# EAGLE schematic 6way (EAGLE 6.4)
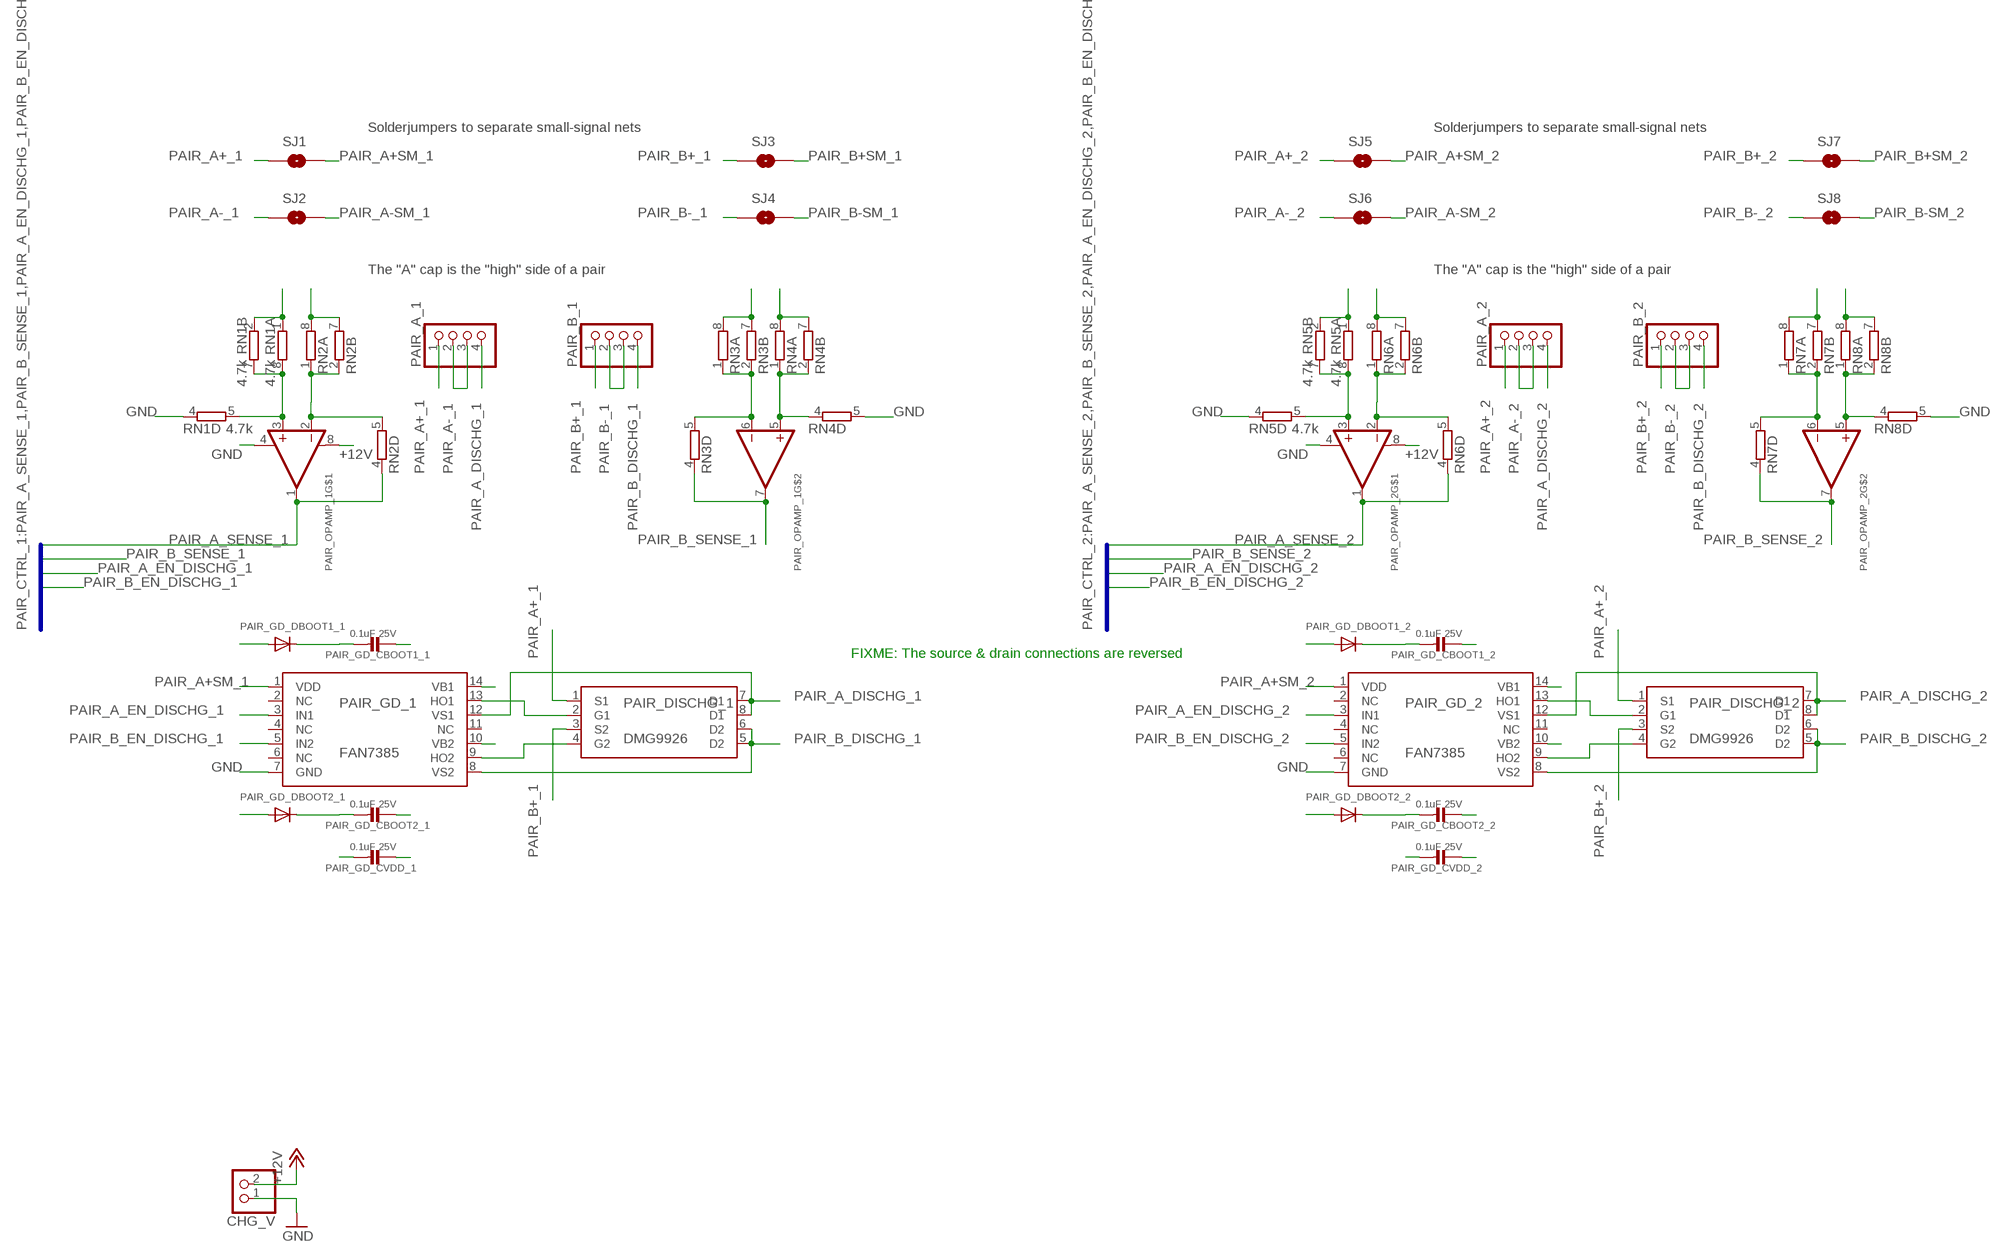
[diagram p0: schematic, sheet 1, part 1 of 2]
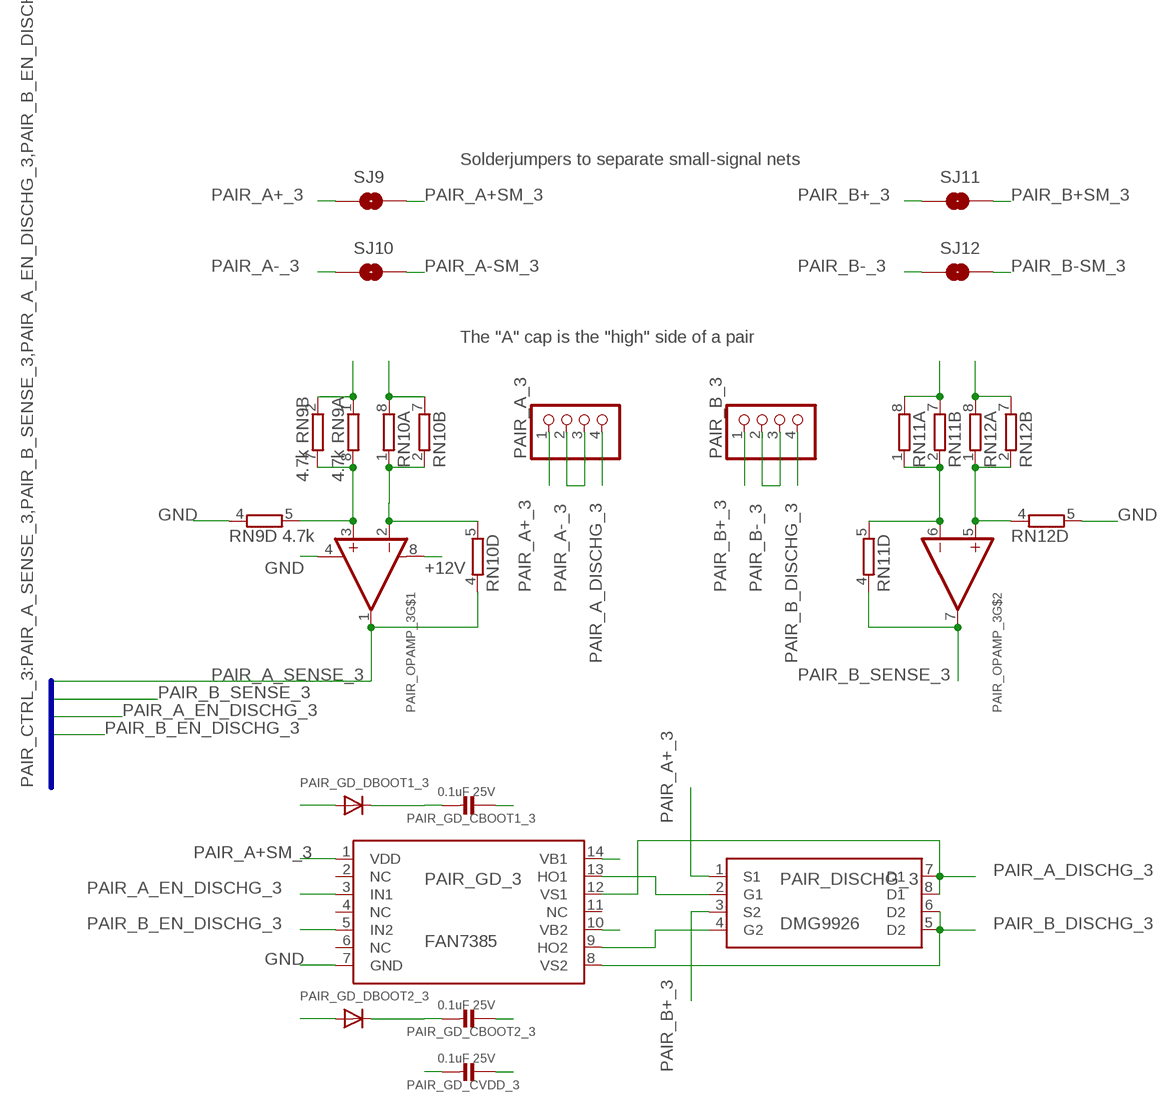
[diagram p1: schematic, sheet 1, part 2 of 2]

## Parts
CHG_V  PINHD-1X2  [1X02]
PAIR_A_1  PINHD-1X4  [1X04]
PAIR_A_2  PINHD-1X4  [1X04]
PAIR_A_3  PINHD-1X4  [1X04]
PAIR_B_1  PINHD-1X4  [1X04]
PAIR_B_2  PINHD-1X4  [1X04]
PAIR_B_3  PINHD-1X4  [1X04]
PAIR_DISCHG_1  DMG9926  [SOP8-L]
PAIR_DISCHG_2  DMG9926  [SOP8-L]
PAIR_DISCHG_3  DMG9926  [SOP8-L]
PAIR_GD_1  FAN7385  [SOT14]
PAIR_GD_2  FAN7385  [SOT14]
PAIR_GD_3  FAN7385  [SOT14]
PAIR_GD_CBOOT1_1  0.1uF 25V  CAP_CERAMIC0805  [0805]
PAIR_GD_CBOOT1_2  0.1uF 25V  CAP_CERAMIC0805  [0805]
PAIR_GD_CBOOT1_3  0.1uF 25V  CAP_CERAMIC0805  [0805]
PAIR_GD_CBOOT2_1  0.1uF 25V  CAP_CERAMIC0805  [0805]
PAIR_GD_CBOOT2_2  0.1uF 25V  CAP_CERAMIC0805  [0805]
PAIR_GD_CBOOT2_3  0.1uF 25V  CAP_CERAMIC0805  [0805]
PAIR_GD_CVDD_1  0.1uF 25V  CAP_CERAMIC0805  [0805]
PAIR_GD_CVDD_2  0.1uF 25V  CAP_CERAMIC0805  [0805]
PAIR_GD_CVDD_3  0.1uF 25V  CAP_CERAMIC0805  [0805]
PAIR_GD_DBOOT1_1  DIODESOT23_WIDE  [SOT23-WIDE]
PAIR_GD_DBOOT1_2  DIODESOT23_WIDE  [SOT23-WIDE]
PAIR_GD_DBOOT1_3  DIODESOT23_WIDE  [SOT23-WIDE]
PAIR_GD_DBOOT2_1  DIODESOT23_WIDE  [SOT23-WIDE]
PAIR_GD_DBOOT2_2  DIODESOT23_WIDE  [SOT23-WIDE]
PAIR_GD_DBOOT2_3  DIODESOT23_WIDE  [SOT23-WIDE]
PAIR_OPAMP_1  LM358  [SOIC8_150MIL]
PAIR_OPAMP_2  LM358  [SOIC8_150MIL]
PAIR_OPAMP_3  LM358  [SOIC8_150MIL]
RN1  4.7k  4R-NCAY16  [CAY16]
RN2  4R-NCAY16  [CAY16]
RN3  4R-NCAY16  [CAY16]
RN4  4R-NCAY16  [CAY16]
RN5  4.7k  4R-NCAY16  [CAY16]
RN6  4R-NCAY16  [CAY16]
RN7  4R-NCAY16  [CAY16]
RN8  4R-NCAY16  [CAY16]
RN9  4.7k  4R-NCAY16  [CAY16]
RN10  4R-NCAY16  [CAY16]
RN11  4R-NCAY16  [CAY16]
RN12  4R-NCAY16  [CAY16]
SJ1  SOLDERJUMPERTRACE  [SJ_2S-TRACE]
SJ2  SOLDERJUMPERTRACE  [SJ_2S-TRACE]
SJ3  SOLDERJUMPERTRACE  [SJ_2S-TRACE]
SJ4  SOLDERJUMPERTRACE  [SJ_2S-TRACE]
SJ5  SOLDERJUMPERTRACE  [SJ_2S-TRACE]
SJ6  SOLDERJUMPERTRACE  [SJ_2S-TRACE]
SJ7  SOLDERJUMPERTRACE  [SJ_2S-TRACE]
SJ8  SOLDERJUMPERTRACE  [SJ_2S-TRACE]
SJ9  SOLDERJUMPERTRACE  [SJ_2S-TRACE]
SJ10  SOLDERJUMPERTRACE  [SJ_2S-TRACE]
SJ11  SOLDERJUMPERTRACE  [SJ_2S-TRACE]
SJ12  SOLDERJUMPERTRACE  [SJ_2S-TRACE]

## Nets
+12V [power]: CHG_V.2 PAIR_OPAMP_1.8(V+) PAIR_OPAMP_2.8(V+) PAIR_OPAMP_3.8(V+)
GND [power]: CHG_V.1 PAIR_GD_1.7(GND) PAIR_GD_2.7(GND) PAIR_GD_3.7(GND) PAIR_GD_CVDD_1.1 PAIR_GD_CVDD_2.1 PAIR_GD_CVDD_3.1 PAIR_OPAMP_1.4(V-) PAIR_OPAMP_2.4(V-) PAIR_OPAMP_3.4(V-) RN1.4 RN4.5 RN5.4 RN8.5 RN9.4 RN12.5
N$1: PAIR_OPAMP_1.6(-IN) RN3.1 RN3.2 RN3.5
N$2: PAIR_OPAMP_1.2(-IN) RN2.1 RN2.2 RN2.5
N$3: PAIR_OPAMP_1.3(+IN) RN1.5 RN1.7 RN1.8
N$4: PAIR_DISCHG_1.2(G1) PAIR_GD_1.13(HO1)
N$5: PAIR_OPAMP_1.5(+IN) RN4.1 RN4.2 RN4.4
N$6: PAIR_DISCHG_1.4(G2) PAIR_GD_1.9(HO2)
N$7: PAIR_OPAMP_2.2(-IN) RN6.1 RN6.2 RN6.5
N$8: PAIR_OPAMP_2.3(+IN) RN5.5 RN5.7 RN5.8
N$9: PAIR_OPAMP_2.6(-IN) RN7.1 RN7.2 RN7.5
N$10: PAIR_OPAMP_2.5(+IN) RN8.1 RN8.2 RN8.4
N$11: PAIR_DISCHG_2.2(G1) PAIR_GD_2.13(HO1)
N$12: PAIR_DISCHG_2.4(G2) PAIR_GD_2.9(HO2)
N$13: PAIR_OPAMP_3.2(-IN) RN10.1 RN10.2 RN10.5
N$14: PAIR_OPAMP_3.3(+IN) RN9.5 RN9.7 RN9.8
N$15: PAIR_OPAMP_3.6(-IN) RN11.1 RN11.2 RN11.5
N$16: PAIR_OPAMP_3.5(+IN) RN12.1 RN12.2 RN12.4
N$17: PAIR_DISCHG_3.2(G1) PAIR_GD_3.13(HO1)
N$18: PAIR_DISCHG_3.4(G2) PAIR_GD_3.9(HO2)
PAIR_A+_1 [high-power]: PAIR_A_1.1 PAIR_DISCHG_1.1(S1) SJ1.1
PAIR_A+_2 [high-power]: PAIR_A_2.1 PAIR_DISCHG_2.1(S1) SJ5.1
PAIR_A+_3 [high-power]: PAIR_A_3.1 PAIR_DISCHG_3.1(S1) SJ9.1
PAIR_A+SM_1: PAIR_GD_1.1(VDD) PAIR_GD_CVDD_1.2 PAIR_GD_DBOOT1_1.1(A) PAIR_GD_DBOOT2_1.1(A) RN1.1 RN1.2 SJ1.2
PAIR_A+SM_2: PAIR_GD_2.1(VDD) PAIR_GD_CVDD_2.2 PAIR_GD_DBOOT1_2.1(A) PAIR_GD_DBOOT2_2.1(A) RN5.1 RN5.2 SJ5.2
PAIR_A+SM_3: PAIR_GD_3.1(VDD) PAIR_GD_CVDD_3.2 PAIR_GD_DBOOT1_3.1(A) PAIR_GD_DBOOT2_3.1(A) RN9.1 RN9.2 SJ9.2
PAIR_A-_1 [high-power]: PAIR_A_1.2 PAIR_A_1.3 SJ2.1
PAIR_A-_2 [high-power]: PAIR_A_2.2 PAIR_A_2.3 SJ6.1
PAIR_A-_3 [high-power]: PAIR_A_3.2 PAIR_A_3.3 SJ10.1
PAIR_A-SM_1: RN2.7 RN2.8 SJ2.2
PAIR_A-SM_2: RN6.7 RN6.8 SJ6.2
PAIR_A-SM_3: RN10.7 RN10.8 SJ10.2
PAIR_A_DISCHG_1 [high-power]: PAIR_A_1.4 PAIR_DISCHG_1.7(D1) PAIR_DISCHG_1.8(D1) PAIR_GD_1.12(VS1) PAIR_GD_CBOOT1_1.1
PAIR_A_DISCHG_2 [high-power]: PAIR_A_2.4 PAIR_DISCHG_2.7(D1) PAIR_DISCHG_2.8(D1) PAIR_GD_2.12(VS1) PAIR_GD_CBOOT1_2.1
PAIR_A_DISCHG_3 [high-power]: PAIR_A_3.4 PAIR_DISCHG_3.7(D1) PAIR_DISCHG_3.8(D1) PAIR_GD_3.12(VS1) PAIR_GD_CBOOT1_3.1
PAIR_A_EN_DISCHG_1: PAIR_GD_1.3(IN1)
PAIR_A_EN_DISCHG_2: PAIR_GD_2.3(IN1)
PAIR_A_EN_DISCHG_3: PAIR_GD_3.3(IN1)
PAIR_A_SENSE_1: PAIR_OPAMP_1.1(OUT) RN2.4
PAIR_A_SENSE_2: PAIR_OPAMP_2.1(OUT) RN6.4
PAIR_A_SENSE_3: PAIR_OPAMP_3.1(OUT) RN10.4
PAIR_B+_1 [high-power]: PAIR_B_1.1 PAIR_DISCHG_1.3(S2) SJ3.1
PAIR_B+_2 [high-power]: PAIR_B_2.1 PAIR_DISCHG_2.3(S2) SJ7.1
PAIR_B+_3 [high-power]: PAIR_B_3.1 PAIR_DISCHG_3.3(S2) SJ11.1
PAIR_B+SM_1: RN4.7 RN4.8 SJ3.2
PAIR_B+SM_2: RN8.7 RN8.8 SJ7.2
PAIR_B+SM_3: RN12.7 RN12.8 SJ11.2
PAIR_B-_1 [high-power]: PAIR_B_1.2 PAIR_B_1.3 SJ4.1
PAIR_B-_2 [high-power]: PAIR_B_2.2 PAIR_B_2.3 SJ8.1
PAIR_B-_3 [high-power]: PAIR_B_3.2 PAIR_B_3.3 SJ12.1
PAIR_B-SM_1: RN3.7 RN3.8 SJ4.2
PAIR_B-SM_2: RN7.7 RN7.8 SJ8.2
PAIR_B-SM_3: RN11.7 RN11.8 SJ12.2
PAIR_B_DISCHG_1 [high-power]: PAIR_B_1.4 PAIR_DISCHG_1.5(D2) PAIR_DISCHG_1.6(D2) PAIR_GD_1.8(VS2) PAIR_GD_CBOOT2_1.1
PAIR_B_DISCHG_2 [high-power]: PAIR_B_2.4 PAIR_DISCHG_2.5(D2) PAIR_DISCHG_2.6(D2) PAIR_GD_2.8(VS2) PAIR_GD_CBOOT2_2.1
PAIR_B_DISCHG_3 [high-power]: PAIR_B_3.4 PAIR_DISCHG_3.5(D2) PAIR_DISCHG_3.6(D2) PAIR_GD_3.8(VS2) PAIR_GD_CBOOT2_3.1
PAIR_B_EN_DISCHG_1: PAIR_GD_1.5(IN2)
PAIR_B_EN_DISCHG_2: PAIR_GD_2.5(IN2)
PAIR_B_EN_DISCHG_3: PAIR_GD_3.5(IN2)
PAIR_B_SENSE_1: PAIR_OPAMP_1.7(OUT) RN3.4
PAIR_B_SENSE_2: PAIR_OPAMP_2.7(OUT) RN7.4
PAIR_B_SENSE_3: PAIR_OPAMP_3.7(OUT) RN11.4
PAIR_GD_VB1_1: PAIR_GD_1.14(VB1) PAIR_GD_CBOOT1_1.2 PAIR_GD_DBOOT1_1.3(C)
PAIR_GD_VB1_2: PAIR_GD_2.14(VB1) PAIR_GD_CBOOT1_2.2 PAIR_GD_DBOOT1_2.3(C)
PAIR_GD_VB1_3: PAIR_GD_3.14(VB1) PAIR_GD_CBOOT1_3.2 PAIR_GD_DBOOT1_3.3(C)
PAIR_GD_VB2_1: PAIR_GD_1.10(VB2) PAIR_GD_CBOOT2_1.2 PAIR_GD_DBOOT2_1.3(C)
PAIR_GD_VB2_2: PAIR_GD_2.10(VB2) PAIR_GD_CBOOT2_2.2 PAIR_GD_DBOOT2_2.3(C)
PAIR_GD_VB2_3: PAIR_GD_3.10(VB2) PAIR_GD_CBOOT2_3.2 PAIR_GD_DBOOT2_3.3(C)
Unconnected: PAIR_GD_1.2(NC) PAIR_GD_1.4(NC) PAIR_GD_1.6(NC) PAIR_GD_1.11(NC) PAIR_GD_2.2(NC) PAIR_GD_2.4(NC) PAIR_GD_2.6(NC) PAIR_GD_2.11(NC) PAIR_GD_3.2(NC) PAIR_GD_3.4(NC) PAIR_GD_3.6(NC) PAIR_GD_3.11(NC) RN1.3 RN1.6 RN2.3 RN2.6 RN3.3 RN3.6 RN4.3 RN4.6 RN5.3 RN5.6 RN6.3 RN6.6 RN7.3 RN7.6 RN8.3 RN8.6 RN9.3 RN9.6 RN10.3 RN10.6 RN11.3 RN11.6 RN12.3 RN12.6

## Buses
PAIR_CTRL_1:PAIR_A_SENSE_1,PAIR_B_SENSE_1,PAIR_A_EN_DISCHG_1,PAIR_B_EN_DISCHG_1
PAIR_CTRL_2:PAIR_A_SENSE_2,PAIR_B_SENSE_2,PAIR_A_EN_DISCHG_2,PAIR_B_EN_DISCHG_2
PAIR_CTRL_3:PAIR_A_SENSE_3,PAIR_B_SENSE_3,PAIR_A_EN_DISCHG_3,PAIR_B_EN_DISCHG_3

## Notes on the sheet
- Solderjumpers to separate small-signal nets | Solderjumpers to separate small-signal nets | Solderjumpers to separate small-signal nets
- The "A" cap is the "high" side of a pair | The "A" cap is the "high" side of a pair | The "A" cap is the "high" side of a pair
- FIXME: The source & drain connections are reversed

## Library data of the parts
CHG_V = pinhead:PINHD-1X2: PIN HEADER
PAIR_A_1-PAIR_A_3 PAIR_B_1-PAIR_B_3 = pinhead:PINHD-1X4: PIN HEADER
PAIR_DISCHG_1-PAIR_DISCHG_3 = DMG9926:DMG9926
PAIR_GD_1-PAIR_GD_3 = fan7385:FAN7385: edit this description Auto generated by make-symbol-device-package-bsdl.ulp Rev. 43 Source:
PAIR_GD_CBOOT1_1-PAIR_GD_CBOOT1_3 PAIR_GD_CBOOT2_1-PAIR_GD_CBOOT2_3 PAIR_GD_CVDD_1-PAIR_GD_CVDD_3 = microbuilder:CAP_CERAMIC: Ceramic Capacitors 0402 - 0402 Surface Mount Capacitors 16pF 50V 5% [Digikey: 445-4899-2-ND] 18pF 50V 5% [Digikey: 490-1281-2-ND] 22pF 50V 5% [Digikey: 490-1283-2-ND] 68pF 50V 5% [Digikey: 490-1289-2-ND] 0.1uF 10V 10% [Digikey: 490-1318-2-ND] 1.0uF 6.3V 10% [Digikey: 490-1320-2-ND] 0603 - 0603 Surface Mount Capacitors 16 pF 50V 5% [Digikey: 445-5051-2-ND] 22 pF 50V [Digikey: PCC220ACVTR-ND] 33 pF 50V 5% [Digikey: 490-1415-1-ND] 56pF 50V 5% [Digikey: 490-1421-1-ND] 220pF 50V 5% [Digikey: 445-1285-1-ND] 680 pF 50V 2200 pF 50V 5% C0G [Digikey: 445-1297-1-ND] 5600 pF 100V 5% X7R [Digikey: 478-3711-1-ND] 0.1 µF 25V 10% [Digikey: PCC2277TR-ND] 0.22 µF 16V 10% X7R [Digikey: 445-1318-1-ND] 1.0 µF 25V 10% [Digikey: 445-5146-2-ND] 0603 - RF Specific 3pF 250V +/-0.1pF RF [Digikey: 712-1347-1-ND] 18 pF 250V 5% [Digikey: 478-3505-1-ND or 712-1322-1-ND] 56 pF 250V 5% C0G RF [Digikey: 490-4867-1-ND] 68 pF 250V RF [Digikey: 490-4868-1-ND] 0805 - 0805 Surface Mount Capacitors 220 pF 250V 2% RF Ceramic Capacitor [Digikey: 712-1398-1-ND] 1000 pF 50V 2% NP0 Ceramic Capacitor [Digikey: 478-3760-1-ND] 0.1 µF 25V 10% Ceramic Capacitor [Digikey: PCC1828TR-ND] 1.0 µF 16V 10% Ceramic Capacitor[Digikey: 490-1691-2-ND] 10.0 µF 10V 10% Ceramic Capacitor[Digikey: 709-1228-1-ND] 10.0 uF 16V 10% Ceramic Capacitor [Digikey: 478-5165-2-ND] 47 uF 6.3V 20% Ceramic Capacitor [Digikey: 587-1779-1-ND or 399-5506-1-ND] 1206 - 1206 Surface Mount Capacitors 47uF 10V 20% Ceramic Capacitor [Digikey: 490-5528-1-ND or 399-5508-1-ND or 445-6010-1-ND] 100uF 6.3V -20%, +80% Y5V Ceramic Capacitor (Digikey: 490-4512-1-ND, Mouser: 81-GRM31CF50J107ZE1L)
PAIR_GD_DBOOT1_1-PAIR_GD_DBOOT1_3 PAIR_GD_DBOOT2_1-PAIR_GD_DBOOT2_3 = microbuilder:DIODE: Diode SMA Model Volts Amps Type Vf Vr Digikey # Notes SSA34-E3 40V 3A Schottky 480mV @ 3A 200uA @ 40V SSA34-E3/61TGITR-ND CDBA120-G 20V 1A Schottky 500mV @ 1A 500uA @ 20V 641-1014-6-ND REEL MBRA210 10V 2A Schottky 350mV @ 2A 700uA @ 10V MBRA210LT3 SOD-123 Model Volts Amps Type Vf Vr Order # Notes BAT54T1G 30V 200mA Schottky 800mV @ 200mA 2uA @ 25V BAT54T1GOSTR-ND B0530W 30V 500mA Schottky 430mV @ 500mA 130uA @ 30V B0530W-FDICT-ND REEL MBR120 1A 20V Schottky 340mV @ 1A MBR120VLSFT1GOSCT-ND SOD-323 Model Volts Amps Type Vf Vr Order # Notes PMEG2005EJ 20V 500mA Schottky 355mV @ 500mA 568-4110-1-ND ZLLS410 10V 570mA Schottky 380mV @ 570mA ZLLS410CT-ND 1N4148WS 75V 150mA Silicon/Simple 1V 1N4148WSFSCT-ND REEL SOD-523 Model Volts Amps Type Vf Vr Order # Notes BAT54XV2 30V 200mA Schottky 0.8V @ 100mA BAT54XV2CT-ND TB751S 30V 30mA Schottky RB751S-40TE61CT-ND SOT23-R/W (R = Solder Paste/Reflow Ovens, W = Hand-Soldering) Model Volts Amps Type Vf Vr Order # Notes BAT54FILM 40V 300mA Schottky 497-7162-1-ND
PAIR_OPAMP_1-PAIR_OPAMP_3 = microbuilder:LM358: LM358 Dual Operational Amplifier Digikey: LM358AMXFSCT-ND
RN1-RN12 = resistor-dil:4R-N: Array Chip Resistor Source: RS Component / Phycomp; OC_FARNELL: unknown; OC_NEWARK: unknown
SJ1-SJ12 = SparkFun-Passives:SOLDERJUMPER: Solder Jumper Standard SMD solder jumper. Used to automate production. Two varients : Normally Open and Normally Closed are the same, but have different paste layers. NC will have a large amount of paste and should jumper during reflow.

## Net classes
1 power: width 0.254 mm
2 high-power: width 0.508 mm